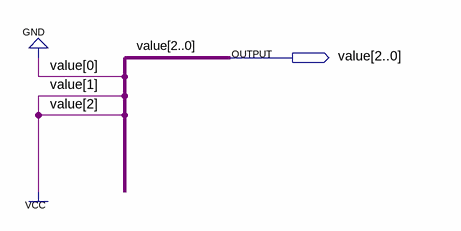
[diagram p0: schematic sheet]
// Quartus schematic dec_3_3bit.bdf as structural Verilog: 0 symbols, 1 pins
module dec_3_3bit (
  output [2:0] value
);


  assign value = 3'b110;
endmodule
